# Altium schematic sheet Varistor.schdoc
size 44 x 28 mm
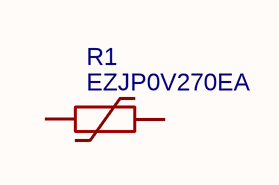
[diagram p0: Varistor.schdoc]

## Parts
R1  EZJP0V270EA  [R0402]

## Nets

Not connected (* = marked no-connect by the designer): R1 1 2

## Library data of the parts
R1 = EZJP0V270EA: Manufacturer: PANASONIC(松下); Contributor: LCSC; Supplier: LCSC; Supplier Part: C336822; Manufacturer Part: EZJP0V270EA; JLCPCB Part Class: Extended Part; spicePre: R; spiceSymbolName: EZJP0V270EA